# EAGLE design Web board (EAGLE 5.00)
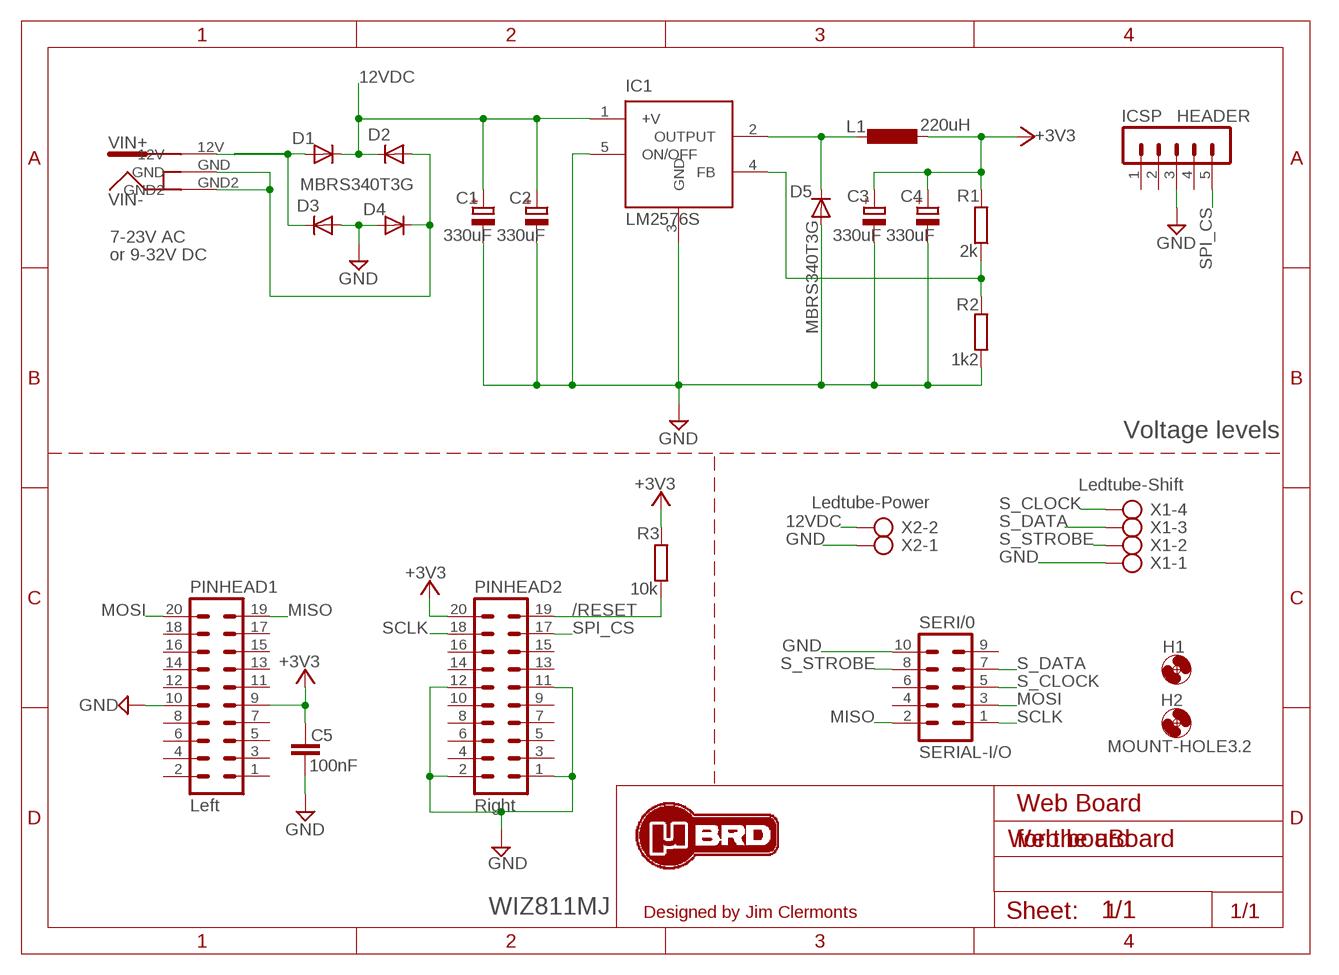
[diagram p0: schematic, sheet 1]

## Parts
ADAPTER  RAPC712X  [733980-62]
C1  330uF  CPOL-EU153CLV-0810  [153CLV-0810]
C2  330uF  CPOL-EU153CLV-0810  [153CLV-0810]
C3  330uF  CPOL-EU153CLV-0810  [153CLV-0810]
C4  330uF  CPOL-EU153CLV-0810  [153CLV-0810]
C5  100nF  C-EUC1206K  [C1206K]
D1  MBRS340T3G  DIODE-SMC  [SMC]
D2  MBRS340T3G  DIODE-SMC  [SMC]
D3  MBRS340T3G  DIODE-SMC  [SMC]
D4  MBRS340T3G  DIODE-SMC  [SMC]
D5  MBRS340T3G  DIODE-SMC  [SMC]
H1  MOUNT-HOLE3.2  [3,2]
H2  MOUNT-HOLE3.2  [3,2]
IC1  LM2576S  LM2576S-ADJ  [TO263-5]
ICSP  HEADER  MA05-1  [MA05-1]
L1  220uH  L-EUPIS2816  [PIS2816]
PINHEAD1  Left  MA10-2  [MA10-2]
PINHEAD2  Right  MA10-2  [MA10-2]
R1  2k  R-EU_M1206  [M1206]
R2  1k2  R-EU_M1206  [M1206]
R3  10k  R-EU_R1206  [R1206]
SERI/0  SERIAL-I/O  MA05-2  [MA05-2]
X1  Ledtube-Shift  AK300/4  [AK300/4]
X2  Ledtube-Power  AK300/2  [AK300/2]

## Nets
12VDC: C1.+ C2.+ D1.C D2.C IC1.1(+V) X2.2
+3V3: C3.+ C4.+ C5.1 L1.2 PINHEAD1.9 PINHEAD2.20 R1.2 R3.2
/RESET: PINHEAD2.19 R3.1
GND: C1.- C2.- C3.- C4.- C5.2 D3.A D4.A D5.A IC1.3(GND) IC1.5(ON/OFF) ICSP.3 PINHEAD1.10 PINHEAD2.1 PINHEAD2.2 PINHEAD2.11 PINHEAD2.12 R2.2 SERI/0.10 X1.1 X2.1
MISO: PINHEAD1.19 SERI/0.2
MOSI: PINHEAD1.20 SERI/0.3
N$1: D5.C IC1.2(OUTPUT) L1.1
N$8: IC1.4(FB) R1.1 R2.1
S_CLOCK: SERI/0.5 X1.4
S_DATA: SERI/0.7 X1.3
S_STROBE: SERI/0.8 X1.2
SCLK: PINHEAD2.18 SERI/0.1
SPI_CS: ICSP.5 PINHEAD2.17
VIN+: ADAPTER.12V D1.A D3.C
VIN-: ADAPTER.GND ADAPTER.GND2 D2.A D4.C
Unconnected: ICSP.1 ICSP.2 ICSP.4 PINHEAD1.1 PINHEAD1.2 PINHEAD1.3 PINHEAD1.4 PINHEAD1.5 PINHEAD1.6 PINHEAD1.7 PINHEAD1.8 PINHEAD1.11 PINHEAD1.12 PINHEAD1.13 PINHEAD1.14 PINHEAD1.15 PINHEAD1.16 PINHEAD1.17 PINHEAD1.18 PINHEAD2.3 PINHEAD2.4 PINHEAD2.5 PINHEAD2.6 PINHEAD2.7 PINHEAD2.8 PINHEAD2.9 PINHEAD2.10 PINHEAD2.13 PINHEAD2.14 PINHEAD2.15 PINHEAD2.16 SERI/0.4 SERI/0.6 SERI/0.9

## Notes on the sheet
- 7-23V AC
- or 9-32V DC
- Voltage levels
- Web Board
- for the uBoard
- WIZ811MJ | Designed by Jim Clermonts | 1 | 1/1

## Library data of the parts
ADAPTER = RAPC712X:RAPC712X
C1-C4 = rcl:CPOL-EU: POLARIZED CAPACITOR, European symbol
C5 = rcl:C-EU: CAPACITOR, European symbol
D1-D5 = diode:DIODE-: DIODE
H1 H2 = holes:MOUNT-HOLE: MOUNTING HOLE with drill center marker
IC1 = LM2576:LM2576*: Switching Step-Down Voltage Regulator Capable of 3A output current. Wide input voltage range. Temp range -40 to 125 C
ICSP = con-lstb:MA05-1: PIN HEADER
L1 = rcl:L-EU: INDUCTOR, European symbol
PINHEAD1 PINHEAD2 = con-lstb:MA10-2: PIN HEADER
R1-R3 = rcl:R-EU_: RESISTOR, European symbol
SERI/0 = con-lstb:MA05-2: PIN HEADER
X1 = con-ptr500:AK300/4: CONNECTOR
X2 = con-ptr500:AK300/2: CONNECTOR

## Board
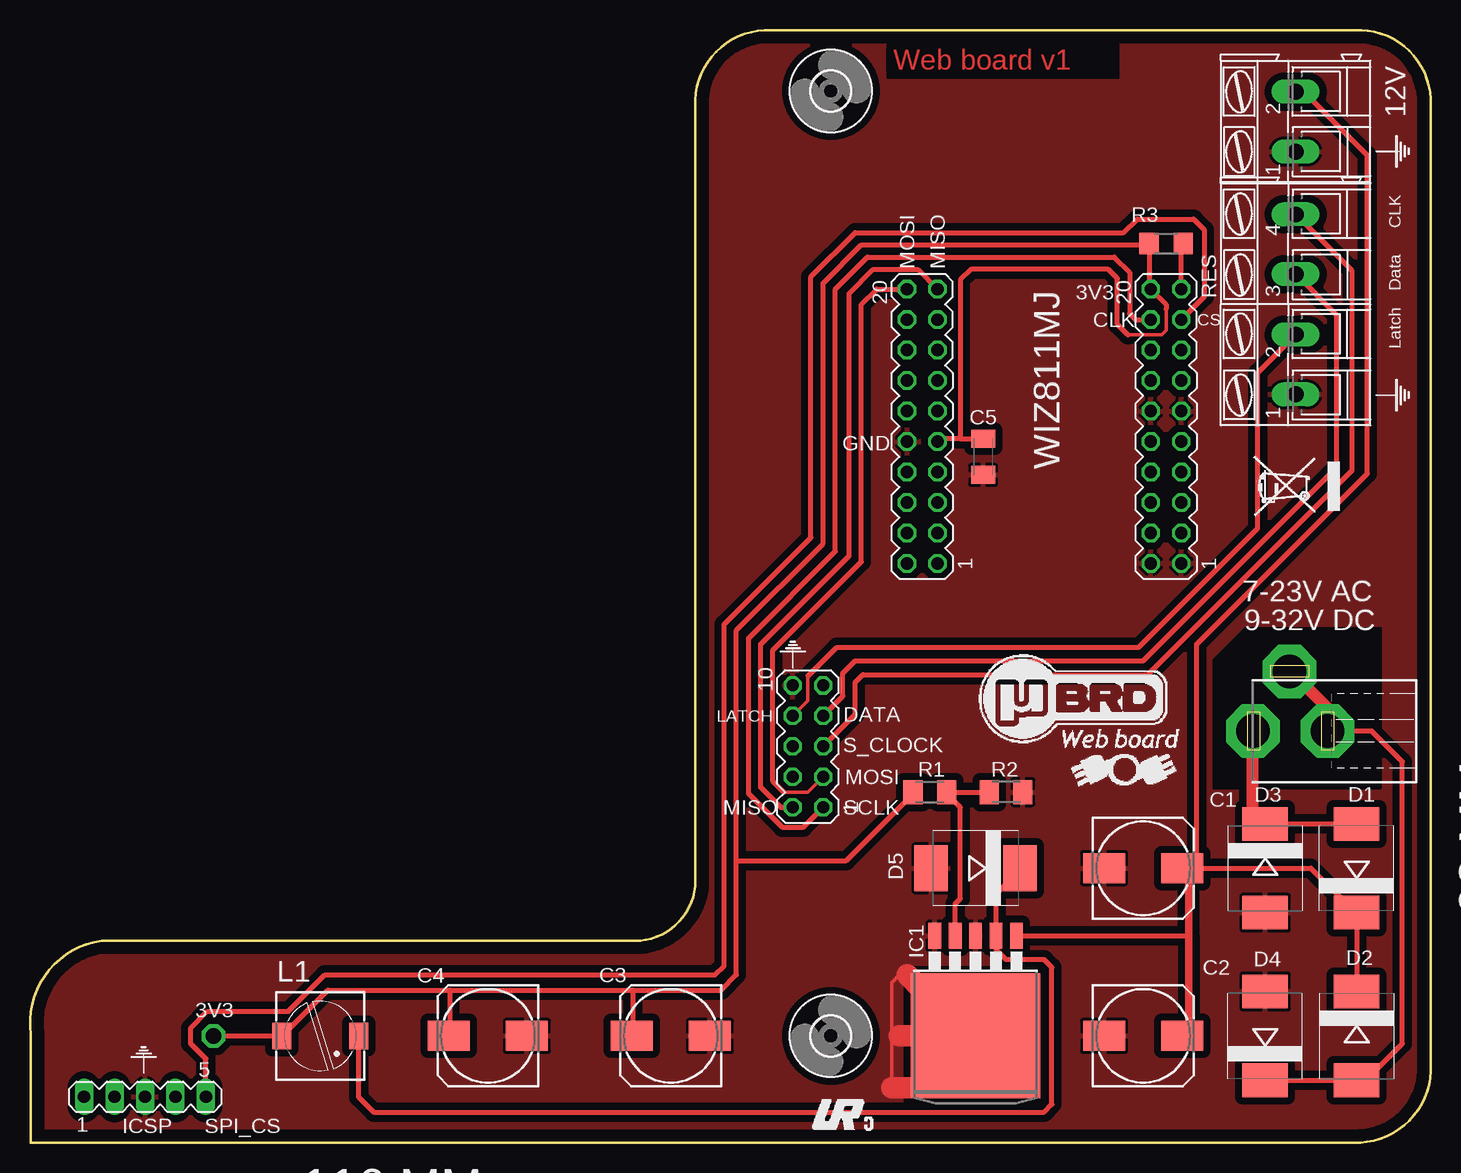
[diagram p1: board, top side]
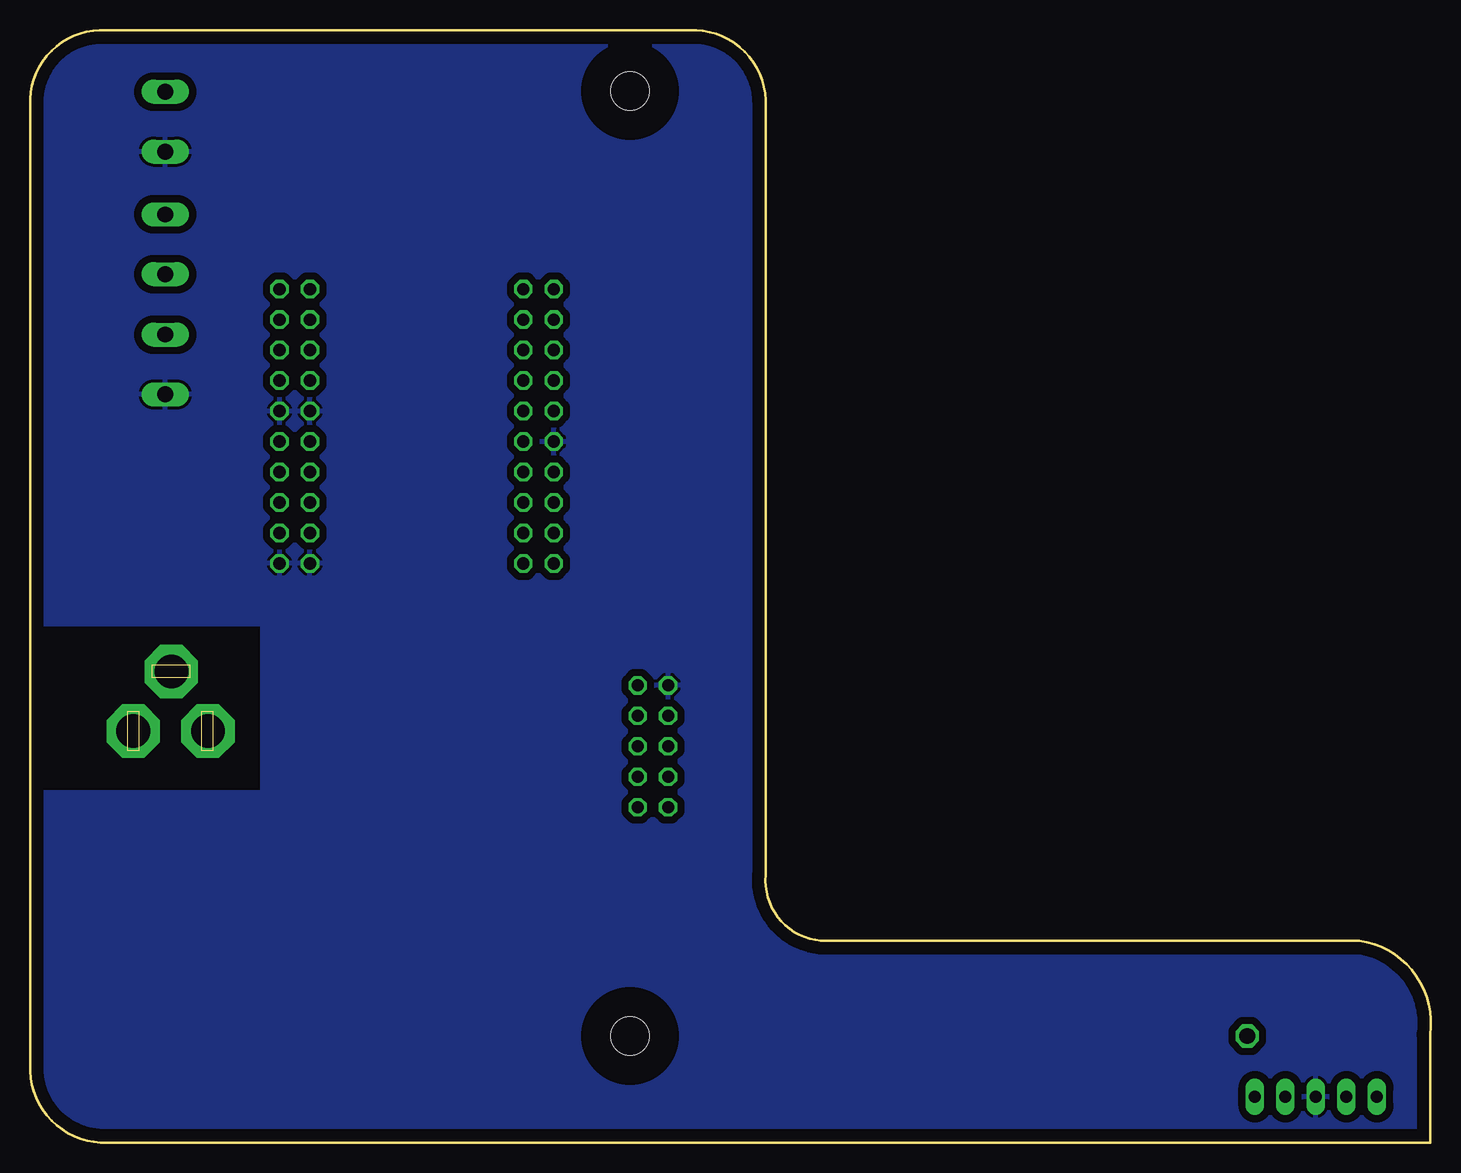
[diagram p2: board, bottom side, seen from below]

Size 116.74 x 92.71 mm. Coordinates in mm from the lower left corner, seen from the top.
Outline: 0.06,0 110.84,0 arc90 116.73,6.52 116.73,86.98 arc90 110.37,92.71 61.79,92.71 arc90 55.43,86.86 55.43,22.3 arc-90 50.84,16.82 5.97,16.82 arc90 0.06,9 0.06,0
Copper layers (1*16): Top 0.035mm / dielectric 1.5mm / Bottom 0.035mm
Design rules "default *": minimum track width 10mil, minimum drill 24mil, track to track 24mil, track to pad 24mil, pad to pad 24mil, via to via 24mil, smd to smd 24mil, copper to edge 40mil, drill to drill 8mil, minimum pad ring 10mil, minimum via ring 8mil, stop-mask expansion 4mil, vias tented up to drill 0mil, thermal gap 10mil

### Footprints (pad centres in the part's own frame; a part is rotated, then mirrored left to right if it is on the bottom)
733980-62 = drill 2.8 pad 4.445 octagon: 12V 0,8.636; GND 4.953,5.588; GND2 0,2.413
153CLV-0810 = smd 3.5 x 2.5: + 3.25,0; - -3.25,0
C1206K = smd 1.5 x 2: 1 -1.5,0; 2 1.5,0
SMC = smd 2.8 x 3.8: A 3.7,0; C -3.7,0
3,2 = hole 3.2: 0,0
TO263-5 = smd 1.067 x 2.159: 1 -3.404,-5.791; 2 -1.702,-5.791; 3 0,-5.791; 4 1.702,-5.791; 5 3.404,-5.791 | smd 10.8 x 10.41: 6 0,2.54
MA05-1 = drill 1.016 long: 1 -5.08,0; 2 -2.54,0; 3 0,0; 4 2.54,0; 5 5.08,0
PIS2816 = smd 2.2 x 1.6: 1 0,3.2; 2 0,-3.2
MA10-2 = drill 1.016 octagon: 1 -11.43,-1.27; 2 -11.43,1.27; 3 -8.89,-1.27; 4 -8.89,1.27; 5 -6.35,-1.27; 6 -6.35,1.27; 7 -3.81,-1.27; 8 -3.81,1.27; 9 -1.27,-1.27; 10 -1.27,1.27; 11 1.27,-1.27; 12 1.27,1.27; 13 3.81,-1.27; 14 3.81,1.27; 15 6.35,-1.27; 16 6.35,1.27; 17 8.89,-1.27; 18 8.89,1.27; 19 11.43,-1.27; 20 11.43,1.27
M1206 = smd 1.6 x 2: 1 -1.4,0; 2 1.4,0
R1206 = smd 1.6 x 1.803: 1 -1.422,0; 2 1.422,0
MA05-2 = drill 1.016 octagon: 1 -5.08,-1.27; 2 -5.08,1.27; 3 -2.54,-1.27; 4 -2.54,1.27; 5 0,-1.27; 6 0,1.27; 7 2.54,-1.27; 8 2.54,1.27; 9 5.08,-1.27; 10 5.08,1.27
AK300/4 = drill 1.321 long: 1 -7.493,0; 2 -2.515,0; 3 2.515,0; 4 7.493,0
AK300/2 = drill 1.321 long: 1 -2.515,0; 2 2.489,0

### Placement (x,y rotation side)
ADAPTER  110.55,34.29 90 top
C1  92.77,22.86 0 top
C2  92.77,8.89 0 top
C3  53.4,8.89 180 top
C4  38.16,8.89 180 top
C5  79.43,57.15 270 top
D1  110.55,22.86 90 top
D2  110.55,8.89 270 top
D3  102.93,22.86 270 top
D4  102.93,8.89 90 top
D5  78.8,22.86 180 top
H1  66.73,8.89 0 top
H2  66.73,87.63 0 top
IC1  78.8,11.43 180 top
ICSP  9.58,3.81 0 top
L1  24.19,8.89 270 top
PINHEAD1  74.35,59.69 90 top
PINHEAD2  94.67,59.69 90 top
R1  74.99,29.21 180 top
R2  81.34,29.21 0 top
R3  94.67,74.93 180 top
SERI/0  64.83,33.02 90 top
X1  105.47,69.85 90 top
X2  105.47,85.09 90 top

### Tracks (layer width: path | path; a pad name or v marks a point on that pad's centre or on a via)
12VDC
  Top 0.406: 110.55,19.05 D2.C | IC1.1 96.5,17.22 96.58,17.14 | 110.55,19.05 D1.C | C1.+ 97.21,22.86 | 97.21,22.86 106.74,22.86 110.55,19.05 | X2.2 106.15,87.58 111.44,82.3 111.44,55.75 97.21,41.53 97.21,22.86
  Top 0.61: C1.+ 96.58,22.86 96.58,17.14 96.58,8.89 C2.+
+3V3  (via drill 1.3)
  Top 0.305: 94.67,69.47 94.67,67.69 94.29,67.31 91.5,67.31
  Top 0.406: C4.+ 34.98,8.89 34.98,12.7 | 34.98,12.7 24.82,12.7 21.01,8.89 L1.2 v15.3,8.89 | 50.52,9.19 C3.+ 50.22,8.89 50.22,12.7 | R1.2 73.72,29.21 68,23.5 58.86,23.5 | 58.86,23.5 58.86,42.67 66.1,49.91 66.1,71.63 69.27,74.8 93.15,74.8 93.28,74.93 R3.2 | 58.86,23.5 58.86,13.97 57.59,12.7 50.22,12.7 | 34.98,12.7 50.22,12.7 | 77.53,58.65 75.85,58.65 PINHEAD1.9 | 77.53,58.65 C5.1 | 77.53,58.65 77.53,71.88 78.42,72.77 89.85,72.77 90.61,72.01 90.61,68.2 91.5,67.31 | 94.67,69.47 94.67,69.85 PINHEAD2.20 93.25,71.27 R3.2 | R3.2 93.02,74.93 93.28,75.18
/RESET
  Top 0.406: R3.1 95.94,74.93 PINHEAD2.19
GND
  Top 0.305: 71.81,4.57 71.81,13.34 72.45,13.97 73.08,13.97
  Top 1.778: 74.99,12.7 74.35,12.7 73.08,13.97 | 72.45,8.89 74.35,8.89 | 71.81,4.57 74.99,4.57
  pour Top: -1.21,17.14 -1.21,-1.27 118.17,-1.27 118.17,29.21 98.36,29.21 98.36,40.39 101.15,43.18 112.83,43.18 112.83,29.46 117.91,29.46 117.66,42.67 117.91,42.67 117.91,43.94 118.17,93.98 90.99,93.98 90.99,88.39 71.18,88.39 71.18,93.98 52.64,93.98 52.64,17.14
  pour Bottom: 54.92,93.22 53.14,17.91 -0.45,17.27 -0.45,-0.76 118.42,-0.76 118.42,29.21 97.34,29.21 97.34,43.18 118.17,43.18 118.93,93.47
MISO
  Top 0.406: PINHEAD1.19 73.97,72.77 70.29,72.77 68.26,70.74 68.26,48.9 60.89,41.53 60.89,29.59 62.54,27.94 SERI/0.2
MOSI
  Top 0.305: SERI/0.3 64.83,29.21 62.8,29.21
  Top 0.406: PINHEAD1.20 70.54,71.12 69.27,69.85 69.27,48.39 61.91,41.02 61.91,30.1 62.8,29.21
N$1
  Top 0.406: D5.C 82.61,22.86 80.5,20.75 IC1.2 80.5,16.08 81.34,15.24 84.51,15.24 85.15,14.61 85.15,3.17 84.51,2.54 28.63,2.54 27.39,3.79 L1.1
N$8
  Top 0.406: 80.07,29.21 R2.1 R1.1 76.26,29.21 77.53,27.94 77.53,20.32 77.1,19.89 IC1.4
S_CLOCK
  Top 0.406: X1.4 110.17,72.64 110.17,56.01 93.15,38.99 69.4,38.99 68.77,38.35 68.77,35.69 SERI/0.5
S_DATA
  Top 0.406: X1.3 105.47,72.39 108.9,68.96 108.9,56.26 92.77,40.13 68.77,40.13 67.75,39.12 67.75,37.21 SERI/0.7
S_STROBE
  Top 0.305: SERI/0.8 64.83,36.83 64.83,38.86
  Top 0.406: X1.2 105.47,67.31 102.29,64.14 102.29,51.18 92.39,41.27 67.24,41.27 64.83,38.86
SCLK
  Top 0.406: PINHEAD2.18 92.13,68.58 91.63,69.09 91.63,72.52 90.36,73.79 69.78,73.79 67.11,71.12 67.11,49.28 59.88,42.04 59.88,29.08 62.67,26.29 64.45,26.29 SERI/0.1
SPI_CS
  Top 0.406: PINHEAD2.17 97.85,70.48 97.85,76.07 96.96,76.96 92.26,76.96 91.12,75.82 68.77,75.82 65.08,72.14 65.08,50.42 57.84,43.18 57.84,14.73 57.08,13.97 24.57,13.97 21.52,10.92 14.79,10.92 13.39,9.53 13.39,8.26 14.66,6.99 ICSP.5
VIN+
  Top 0.406: D3.C D1.A
  Top 1.016: D3.C 102.93,26.67 101.91,27.69 ADAPTER.12V
VIN-
  Top 0.406: D4.C D2.A | D2.A 110.55,5.08 | D2.A 111.29,5.19 114.36,8.26 114.36,31.75 111.82,34.29 ADAPTER.GND2 108.01,34.29
  Top 1.016: ADAPTER.GND 105.09,39.24 108.01,36.32 108.01,34.29

### Text on the board
Top: Web board v1
tPlace: 12V | CLK | MOSI | MISO | 3V3 | WIZ811MJ | Data | RES | Latch | CS | CLK | GND | 7-23V AC | 9-32V DC | LATCH | DATA | S_CLOCK | MOSI | SCLK | MISO | 3V3 | SPI_CS | <- 92 MM -> | <- 116 MM ->